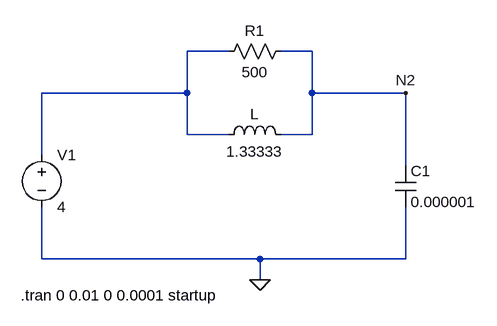
[diagram p0: schematic project2  q22.asc]
project2  q22.asc, the LTspice schematic file:
Version 4
SHEET 1 880 680
WIRE 208 64 144 64
WIRE 336 64 288 64
WIRE 144 128 144 64
WIRE 144 128 -80 128
WIRE 336 128 336 64
WIRE 480 128 336 128
WIRE 144 192 144 128
WIRE 208 192 144 192
WIRE 336 192 336 128
WIRE 336 192 288 192
WIRE -80 224 -80 128
WIRE 480 240 480 128
WIRE -80 384 -80 304
WIRE 256 384 -80 384
WIRE 480 384 480 304
WIRE 480 384 256 384
WIRE 256 416 256 384
FLAG 256 416 0
FLAG 480 128 N2
SYMBOL res 192 80 R270
WINDOW 0 32 56 VTop 0
WINDOW 3 0 56 VBottom 0
SYMATTR InstName R1
SYMATTR Value 500
SYMBOL ind 192 208 R270
WINDOW 0 32 56 VTop 0
WINDOW 3 5 56 VBottom 0
SYMATTR InstName L
SYMATTR Value 1.33333
SYMBOL voltage -80 208 R0
WINDOW 123 0 0 Left 0
WINDOW 39 0 0 Left 0
SYMATTR InstName V1
SYMATTR Value 4
SYMBOL cap 464 240 R0
SYMATTR InstName C1
SYMATTR Value 0.000001
TEXT -112 440 Left 0 !.tran 0 0.01 0 0.0001 startup

The netlist it stands for:
* project2  q22.asc
R1 N001 N2 500
L N001 N2 1.33333
V1 N001 0 4
C1 N2 0 0.000001
.tran 0 0.01 0 0.0001 startup
.backanno
.end